# EAGLE board atmega2560.2 (EAGLE 8.3.0)
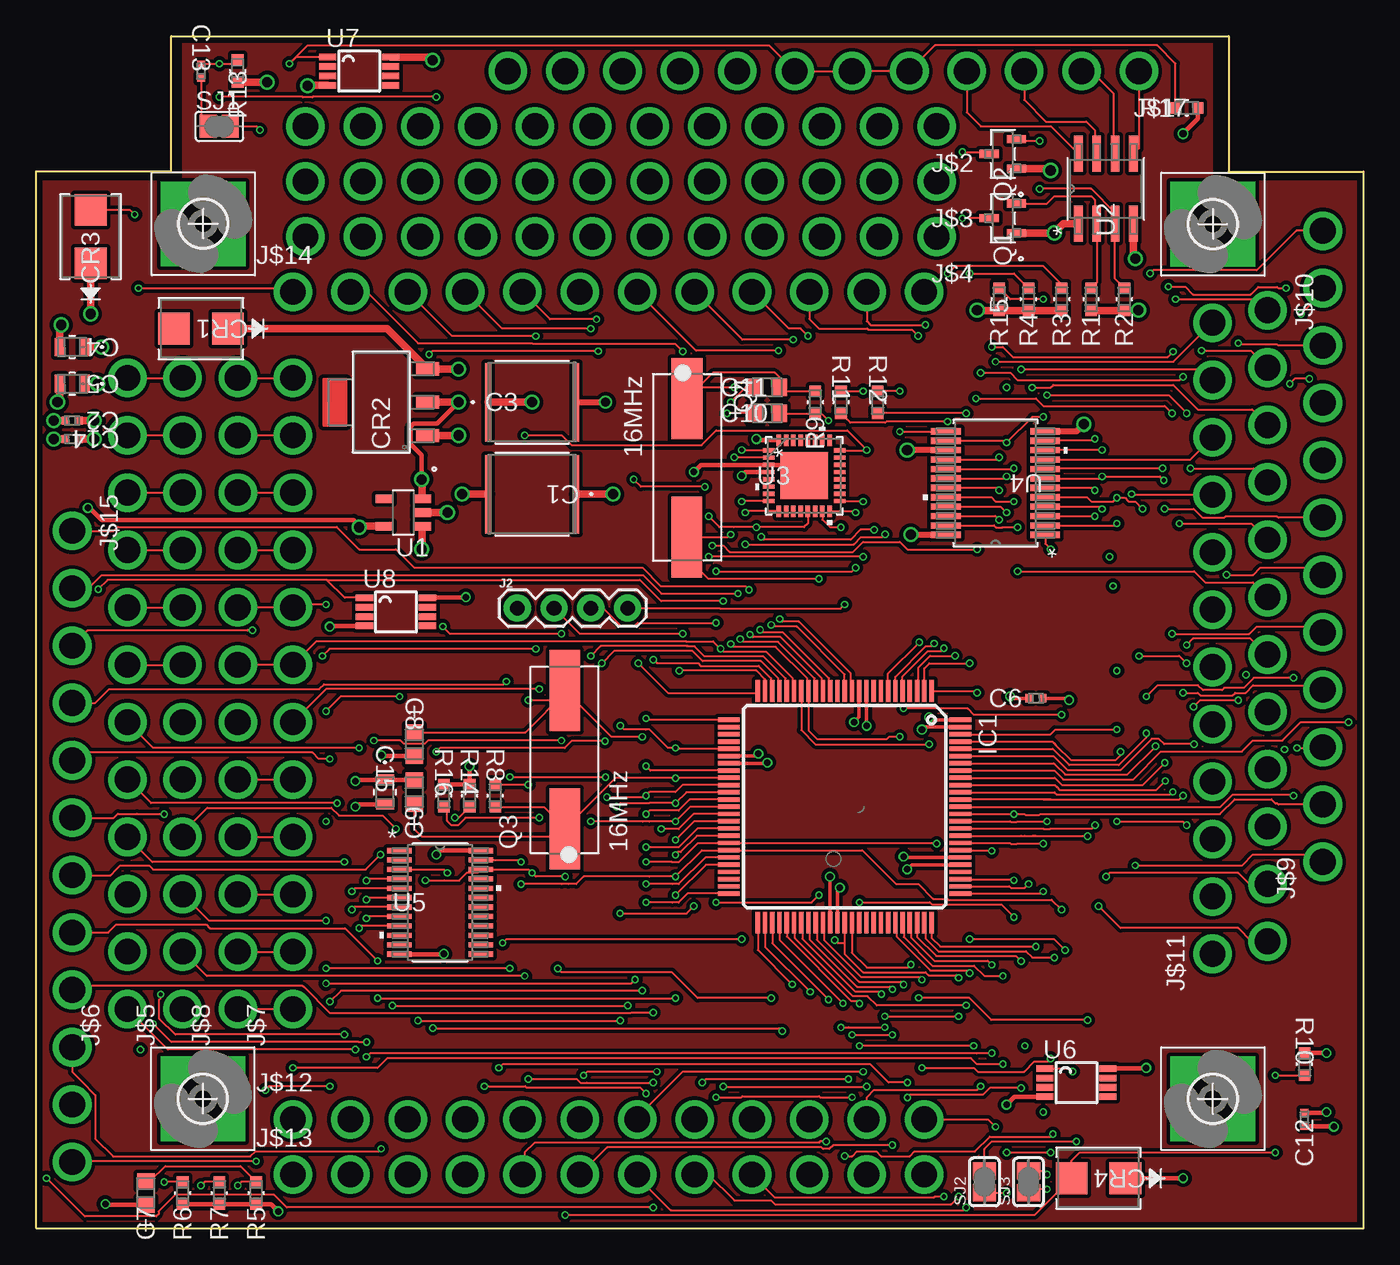
[diagram p7: board, top side]
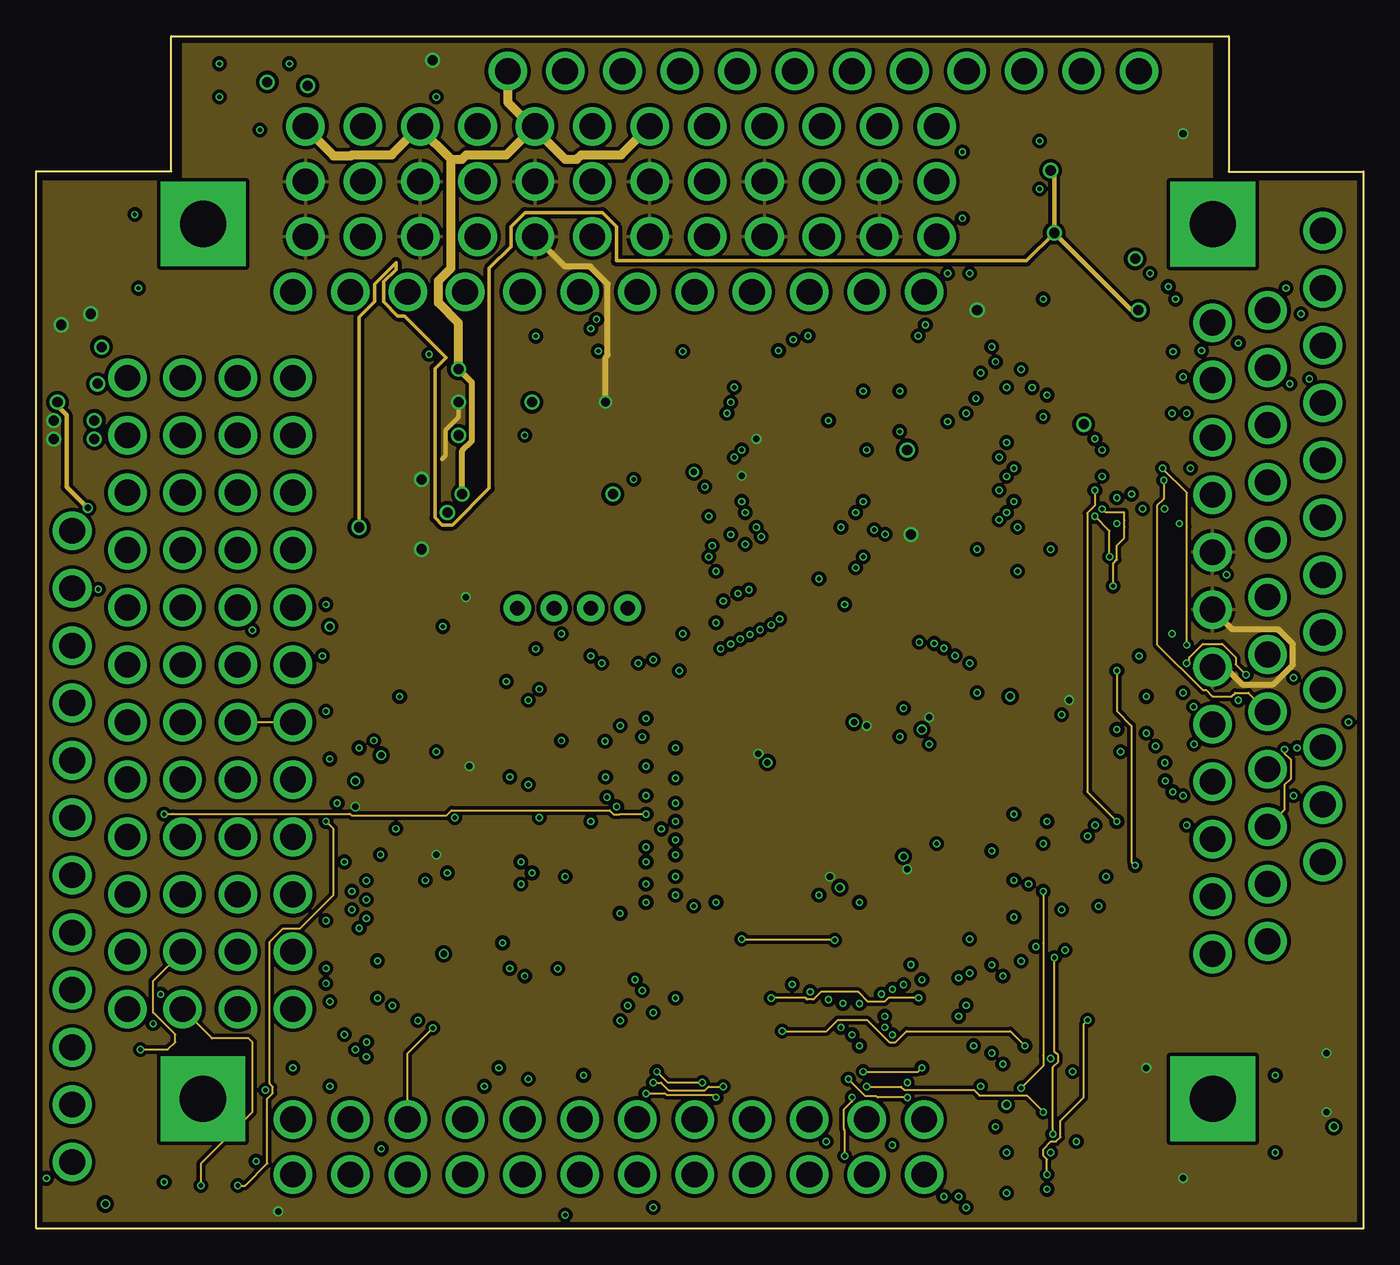
[diagram p8: board, inner layer Route2]
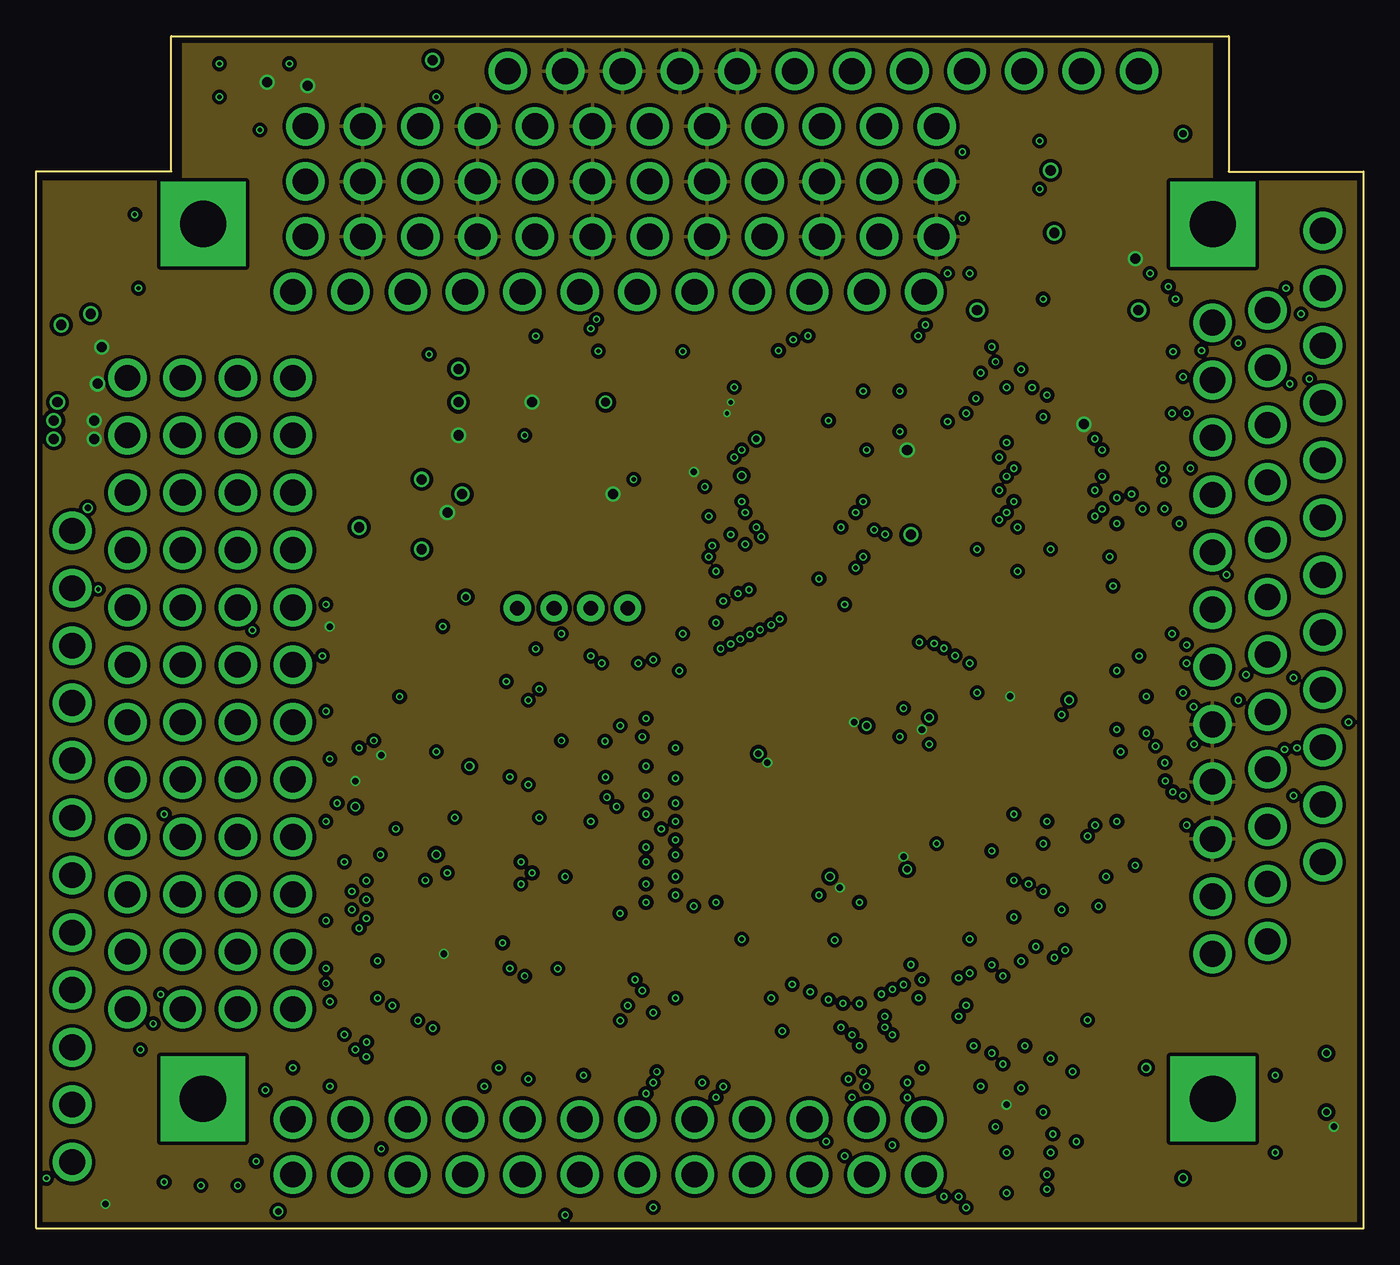
[diagram p9: board, inner layer Route15]
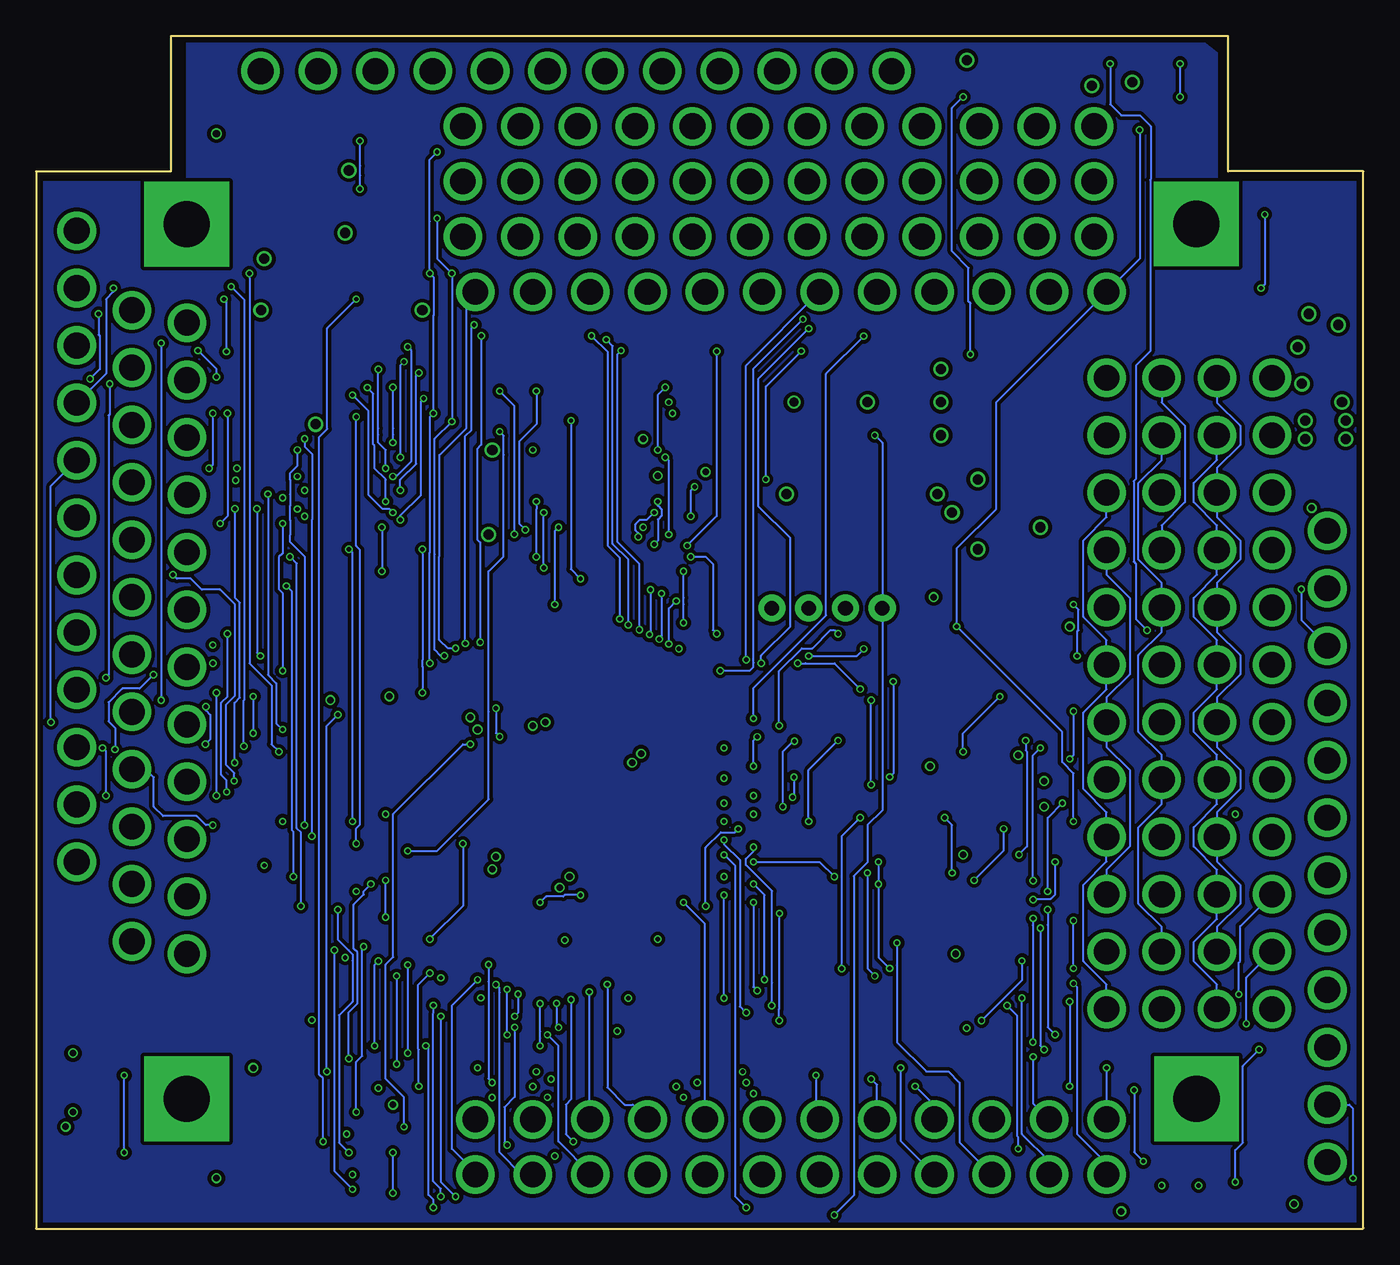
[diagram p10: board, bottom side, seen from below]

Size 91.64 x 82.35 mm. Coordinates in mm from the lower left corner, seen from the top.
Outline: 0,0.03 0,73.02 9.32,73.02 9.32,82.35 82.35,82.35 82.35,73 91.64,73 91.64,0 0.03,0 0,0.03
Copper layers (1*2*15*16): Top 0.035559375mm / dielectric 0.17018125mm / Route2 0.01778125mm / dielectric 47mil / Route15 0.01778125mm / dielectric 0.17018125mm / Bottom 0.035559375mm
Design rules "oshpark-4layer": minimum track width 5mil, minimum drill 10mil, track to track 5mil, track to pad 5mil, pad to pad 5mil, via to via 5mil, smd to smd 5mil, copper to edge 15mil, drill to drill 6mil, minimum pad ring 4mil, minimum via ring 4mil, stop-mask expansion 2.5mil, vias tented up to drill 0mil, thermal gap 10mil
Net classes: 0 default: width 0.203 mm, drill 0.406 mm, clearance 0.203 mm; 1 power: width 0.254 mm; 2 gnd: width 0.305 mm, drill 0.406 mm, clearance 0.203 mm; 3 power usb: width 0.508 mm, drill 0.406 mm, clearance 0.203 mm

## Footprints (pad centres in the part's own frame; a part is rotated, then mirrored left to right if it is on the bottom)
CAP_5750 = smd 0.406 x 5.41: 1 -3.048,0; 2 3.048,0
CAP_01 = smd 0.508 x 0.559: 1 -0.47,0; 2 0.47,0
CAP_GRM219R61A106KE44D = smd 0.711 x 1.245: 1 -0.851,0; 2 0.851,0
CC0805N = smd 1.067 x 1.219: 1 -0.826,0; 2 0.826,0
DIODE_600V_3A = smd 2.18 x 2.21: 1 -1.857,0; 2 1.857,0
SOT-223 = smd 0.914 x 1.6: 1 -2.3,-3.2; 2 0,-3.2; 3 2.3,-3.2
3,2-PAD-SQUARE = drill 3.2 pad 5.842 square: B3,2 0,0
TQFP100 = smd 1.5 x 0.3: 1 -8,6; 2 -8,5.5; 3 -8,5; 4 -8,4.5; 5 -8,4; 6 -8,3.5; 7 -8,3; 8 -8,2.5; 9 -8,2; 10 -8,1.5; 11 -8,1; 12 -8,0.5; 13 -8,0; 14 -8,-0.5; 15 -8,-1; 16 -8,-1.5; 17 -8,-2; 18 -8,-2.5; 19 -8,-3; 20 -8,-3.5; 21 -8,-4; 22 -8,-4.5; 23 -8,-5; 24 -8,-5.5; 25 -8,-6; 51 8,-6; 52 8,-5.5; 53 8,-5; 54 8,-4.5; 55 8,-4; 56 8,-3.5; 57 8,-3; 58 8,-2.5; 59 8,-2; 60 8,-1.5; 61 8,-1; 62 8,-0.5; 63 8,0; 64 8,0.5; 65 8,1; 66 8,1.5; 67 8,2; 68 8,2.5; 69 8,3; 70 8,3.5; 71 8,4; 72 8,4.5; 73 8,5; 74 8,5.5; 75 8,6 | smd 0.3 x 1.5: 26 -6,-8; 27 -5.5,-8; 28 -5,-8; 29 -4.5,-8; 30 -4,-8; 31 -3.5,-8; 32 -3,-8; 33 -2.5,-8; 34 -2,-8; 35 -1.5,-8; 36 -1,-8; 37 -0.5,-8; 38 0,-8; 39 0.5,-8; 40 1,-8; 41 1.5,-8; 42 2,-8; 43 2.5,-8; 44 3,-8; 45 3.5,-8; 46 4,-8; 47 4.5,-8; 48 5,-8; 49 5.5,-8; 50 6,-8; 76 6,8; 77 5.5,8; 78 5,8; 79 4.5,8; 80 4,8; 81 3.5,8; 82 3,8; 83 2.5,8; 84 2,8; 85 1.5,8; 86 1,8; 87 0.5,8; 88 0,8; 89 -0.5,8; 90 -1,8; 91 -1.5,8; 92 -2,8; 93 -2.5,8; 94 -3,8; 95 -3.5,8; 96 -4,8; 97 -4.5,8; 98 -5,8; 99 -5.5,8; 100 -6,8
1X04 = drill 1.016 pad 1.88: 1 0,0; 2 2.54,0; 3 5.08,0; 4 7.62,0
WIREWRAPPOST = drill 1.778 pad 2.54: 1 0,0; 2 3.962,0; 3 7.925,0; 4 11.887,0; 5 15.85,0; 6 19.812,0; 7 23.774,0; 8 27.737,0; 9 31.699,0; 10 35.662,0; 11 39.624,0; 12 43.586,0
SOT-23 = smd 0.561 x 1.321: D 0,0.945; G -1.025,-0.945; S 1.025,-0.945
OSCILLATOR = smd 5.588 x 2.108: 1 2.798,1.05 | smd 5.6 x 2.1: 2 12.36,1.04
RC0603N = smd 0.762 x 0.813: 1 -0.775,0; 2 0.775,0
SJ = smd 1.168 x 1.6: 1 -0.762,0; 2 0.762,0
SOLDERJUMPER_CLOSEDWIRE = smd 1.168 x 1.6: 1 -0.762,0; 2 0.762,0 | smd 0.635 x 0.203: WIRE 0,0
SOT23-5 = smd 0.6 x 1.2: EN 0.95,-1.306; GND 0,-1.306; IN -0.95,-1.306; NC/ADJ 0.95,1.306; OUT -0.95,1.306
R_8-M = smd 2.489 x 0.61: 1 -2.413,1.905; 2 -2.413,0.635; 3 -2.413,-0.635; 4 -2.413,-1.905; 5 2.413,-1.905; 6 2.413,-0.635; 7 2.413,0.635; 8 2.413,1.905
32M1-A = smd 0.805 x 0.3: 1 -2.452,1.75; 2 -2.452,1.25; 3 -2.452,0.75; 4 -2.452,0.25; 5 -2.452,-0.25; 6 -2.452,-0.75; 7 -2.452,-1.25; 8 -2.452,-1.75; 17 2.452,-1.75; 18 2.452,-1.25; 19 2.452,-0.75; 20 2.452,-0.25; 21 2.452,0.25; 22 2.452,0.75; 23 2.452,1.25; 24 2.452,1.75 | smd 0.3 x 0.805: 9 -1.75,-2.452; 10 -1.25,-2.452; 11 -0.75,-2.452; 12 -0.25,-2.452; 13 0.25,-2.452; 14 0.75,-2.452; 15 1.25,-2.452; 16 1.75,-2.452; 25 1.75,2.452; 26 1.25,2.452; 27 0.75,2.452; 28 0.25,2.452; 29 -0.25,2.452; 30 -0.75,2.452; 31 -1.25,2.452; 32 -1.75,2.452 | smd 3.25 x 3.25: 33 0,0
DB24 = smd 2.057 x 0.432: 1 -3.429,3.575; 2 -3.429,2.925; 3 -3.429,2.275; 4 -3.429,1.625; 5 -3.429,0.975; 6 -3.429,0.325; 7 -3.429,-0.325; 8 -3.429,-0.975; 9 -3.429,-1.625; 10 -3.429,-2.275; 11 -3.429,-2.925; 12 -3.429,-3.575; 13 3.429,-3.575; 14 3.429,-2.925; 15 3.429,-2.275; 16 3.429,-1.625; 17 3.429,-0.975; 18 3.429,-0.325; 19 3.429,0.325; 20 3.429,0.975; 21 3.429,1.625; 22 3.429,2.275; 23 3.429,2.925; 24 3.429,3.575
PW24 = smd 1.676 x 0.356: 1 -2.819,3.575; 2 -2.819,2.925; 3 -2.819,2.275; 4 -2.819,1.625; 5 -2.819,0.975; 6 -2.819,0.325; 7 -2.819,-0.325; 8 -2.819,-0.975; 9 -2.819,-1.625; 10 -2.819,-2.275; 11 -2.819,-2.925; 12 -2.819,-3.575; 13 2.819,-3.575; 14 2.819,-2.925; 15 2.819,-2.275; 16 2.819,-1.625; 17 2.819,-0.975; 18 2.819,-0.325; 19 2.819,0.325; 20 2.819,0.975; 21 2.819,1.625; 22 2.819,2.275; 23 2.819,2.925; 24 2.819,3.575
SOP65P500X110-8N = smd 1.2 x 0.45: 1 -2.175,0.975; 2 -2.175,0.325; 3 -2.175,-0.325; 4 -2.175,-0.975; 5 2.175,-0.975; 6 2.175,-0.325; 7 2.175,0.325; 8 2.175,0.975

## Placement (x,y rotation side)
C1  47uF  [CAP_5750]  34.24,50.72 180 top
C2  0.1uF  [CAP_01]  2.49,55.8 180 top
C3  47uF  [CAP_5750]  34.24,57.07 0 top
C4  10uF  [CAP_GRM219R61A106KE44D]  2.49,60.88 180 top
C5  10uF  [CAP_GRM219R61A106KE44D]  2.49,58.34 180 top
C6  0.1uF  [CAP_01]  69.04,36.63 0 top
C7  22pF  [CC0805N]  7.57,2.46 90 top
C8  22pF  [CC0805N]  26.11,33.45 270 top
C9  22pF  [CC0805N]  26.11,30.15 90 top
C10  22pF  [CC0805N]  50.5,56.31 0 top
C11  22pF  [CC0805N]  50.5,58.09 0 top
C12  0.1uF  [CAP_01]  87.58,7.54 90 top
C13  0.1uF  [CAP_01]  11.38,79.93 270 top
C14  0.1uF  [CAP_01]  2.49,54.53 180 top
C15  10uF  [CAP_GRM219R61A106KE44D]  24.08,30.15 270 top
CR1  [DIODE_600V_3A]  11.38,62.15 180 top
CR2  LD1117S50CTR  [SOT-223]  23.83,57.07 90 top
CR3  [DIODE_600V_3A]  3.76,68.5 90 top
CR4  [DIODE_600V_3A]  73.36,3.48 180 top
H1  MOUNT-PAD-SQUARE3.2  [3,2-PAD-SQUARE]  81.25,69.37 0 top
H2  MOUNT-PAD-SQUARE3.2  [3,2-PAD-SQUARE]  11.51,8.97 0 top
H3  MOUNT-PAD-SQUARE3.2  [3,2-PAD-SQUARE]  81.25,8.97 0 top
H4  MOUNT-PAD-SQUARE3.2  [3,2-PAD-SQUARE]  11.53,69.39 0 top
IC1  ATMEGA2560-16AU  [TQFP100]  55.83,29.13 270 top
J2  [1X04]  33.22,42.85 0 top
J$1  WIREPOST  [WIREWRAPPOST]  76.15,79.93 180 top
J$2  WIREPOST  [WIREWRAPPOST]  62.18,76.12 180 top
J$3  WIREPOST  [WIREWRAPPOST]  62.18,72.31 180 top
J$4  WIREPOST  [WIREWRAPPOST]  62.18,68.5 180 top
J$5  WIREPOST  [WIREWRAPPOST]  10.11,15.16 90 top
J$6  WIREPOST  [WIREWRAPPOST]  6.3,15.16 90 top
J$7  WIREPOST  [WIREWRAPPOST]  17.73,15.16 90 top
J$8  WIREPOST  [WIREWRAPPOST]  13.92,15.16 90 top
J$9  WIREPOST  [WIREWRAPPOST]  88.85,25.32 90 top
J$10  WIREPOST  [WIREWRAPPOST]  85.04,63.42 270 top
J$11  WIREPOST  [WIREWRAPPOST]  81.23,18.97 90 top
J$12  WIREPOST  [WIREWRAPPOST]  17.73,7.54 0 top
J$13  WIREPOST  [WIREWRAPPOST]  17.73,3.73 0 top
J$14  WIREPOST  [WIREWRAPPOST]  17.73,64.69 0 top
J$15  WIREPOST  [WIREWRAPPOST]  2.49,48.18 270 top
Q1  BSS138  [SOT-23]  66.75,69.77 90 top
Q2  BSS138  [SOT-23]  66.75,74.22 90 top
Q3  16MHz  [OSCILLATOR]  37.54,24.82 90 top
Q4  16MHz  [OSCILLATOR]  43.89,60.12 270 top
R1  10K  [RC0603N]  72.85,64.19 90 top
R2  10K  [RC0603N]  75.13,64.19 90 top
R3  10K  [RC0603N]  70.82,64.19 90 top
R4  10K  [RC0603N]  68.53,64.19 90 top
R5  10K  [RC0603N]  15.19,2.46 90 top
R6  10K  [RC0603N]  10.11,2.46 90 top
R7  10K  [RC0603N]  12.65,2.46 90 top
R8  1M  [RC0603N]  31.7,29.9 270 top
R9  1M  [RC0603N]  53.8,57.07 90 top
R10  10K  [RC0603N]  87.58,11.35 270 top
R11  1K  [RC0603N]  55.58,57.07 270 top
R12  1K  [RC0603N]  58.12,57.07 270 top
R13  1K  [RC0603N]  13.92,79.93 90 top
R14  10K  [RC0603N]  29.92,29.9 270 top
R15  10K  [RC0603N]  66.5,64.19 90 top
R16  10K  [RC0603N]  28.14,29.9 270 top
R17  [RC0603N]  79.45,77.39 0 top
SJ1  [SJ]  12.65,76.12 0 top
SJ2  [SOLDERJUMPER_CLOSEDWIRE]  65.48,3.23 90 top
SJ3  [SOLDERJUMPER_CLOSEDWIRE]  68.53,3.23 90 top
U1  MIC5225  [SOT23-5]  25.35,49.45 90 top
U2  ADM3488ARZR_8-M  [R_8-M]  73.86,71.81 90 top
U3  [32M1-A]  53.04,51.99 0 top
U4  CD74HC4067SM96  [DB24]  66.24,51.49 180 top
U5  TCA9548APWR  [PW24]  27.89,22.53 0 top
U6  DS18B20U+T&R  [SOP65P500X110-8N]  71.83,10.08 0 top
U7  DS18B20U+T&R  [SOP65P500X110-8N]  22.3,79.93 0 top
U8  DS18B20U+T&R  [SOP65P500X110-8N]  24.84,42.6 0 top

## Tracks (layer width: path | path; a pad name or v marks a point on that pad's centre or on a via)
0SCL  (via drill 0.3)
  Top 0.127: U5.5 22.01,23.5 v21.79,23.29 | v20.78,29.39 7.93,29.39 J$6.5
  Bottom 0.127: v21.79,23.29 21.79,28.37 v20.78,29.39
0SDA  (via drill 0.3)
  Top 0.127: U5.4 22.94,24.15 v22.81,24.02 | v22.3,33.2 8.08,33.2 J$6.6
  Bottom 0.127: v22.81,24.02 22.81,32.69 v22.3,33.2
1SCL  (via drill 0.3)
  Top 0.127: U5.7 21.98,22.2 v21.79,22.02 | v8.6,16.18 8.6,15.91 8.51,15.83 8.51,14.5 9.6,13.41 v21.29,13.41
  Bottom 0.127: v21.79,22.02 21.79,20.98 21.78,20.97 21.78,13.9 v21.29,13.41 | v8.6,16.18 8.6,18.38 8.51,18.46 8.51,20.88 J$6.3
1SDA  (via drill 0.3)
  Top 0.127: U5.6 22.94,22.85 v22.81,22.72 | v21.28,25.32 8.03,25.32 J$6.4
  Bottom 0.127: v21.28,25.32 21.28,23.08 21.58,22.77 22.76,22.77 v22.81,22.72
2SCL  (via drill 0.3)
  Top 0.127: U5.9 22.45,20.9 v22.3,20.75 | v22.05,12.37 9.09,12.37 J$6.1
  Bottom 0.127: v22.3,20.75 22.3,12.62 v22.05,12.37
2SDA  (via drill 0.3)
  Top 0.127: U5.8 22.94,21.55 v22.81,21.42 | v22.82,12.88 22.27,12.88 22.26,12.89 9.34,12.89 v8.08,14.15
  Bottom 0.127: v22.81,21.42 22.81,20.98 22.82,20.97 v22.82,12.88 | v8.08,14.15 8.08,17.35 J$6.2
3.3V  (via drill 0.45, 0.7)
  Top 0.305: v3.56,49.76 3.7,49.76 4.52,48.95 21.93,48.95 22.37,48.5
  Top 0.508: U1.OUT 22.37,48.5 v22.3,48.44 | C5.2 1.64,57.24 v1.47,57.07 | v70.3,68.75 Q1.G | v70.3,68.75 v70.31,68.76 | Q2.G 69.94,73.19 v70.05,73.08 | U2.1 70.94,69.39 v70.3,68.75 | R1.1 R2.1 76.11,63.41 v76.12,63.42
  Route2 0.254: v22.3,48.44 22.3,62.95 23.36,64 23.36,65.24 24.84,66.73 24.84,66.23 23.99,65.38 23.99,64 24.97,63.03 25.43,63.03 28.3,60.15 27.54,59.39 27.54,49.1 28.04,48.6 28.75,48.6 31.28,51.13 31.28,66.32 32.78,67.81 32.78,69.19 33.75,70.17 39.09,70.17 40.07,69.19 40.07,66.84 68.39,66.84 v70.31,68.76
  Route2 0.305: v1.47,57.07 1.47,56.79 2.1,56.17 2.1,51.22 v3.56,49.76 | v76.12,63.42 75.64,63.42 v70.31,68.76 70.31,72.82 v70.05,73.08
5V  (via drill 0.45, 0.5, 0.6, 0.7)
  Top 0.254: IC1.61 54.83,24.29 v54.81,24.31 | IC1.80 60.47,25.13 v60.15,24.82 | IC1.100 61.84,35.13 v61.67,35.3 | C6.2 71.2,36.63 v71.32,36.5 | IC1.10 57.33,34.75 v57.35,34.72 | IC1.31 49.71,32.63 v49.87,32.8
  Top 0.305: U3.4 48.97,52.24 v48.72,51.99 | U3.32 49.82,54.45 v49.73,54.53 | U8.8 29.63,43.57 v29.67,43.61 | U6.8 76.62,11.06 v76.66,11.1 | CR4.1 v79.2,3.48 | C12.2 89.07,8.01 v89.1,8.05 | R10.1 89.09,12.13 v89.1,12.12 | R6.1 R7.1 R5.1 16.22,1.69 v16.71,1.19 | U5.24 27.91,26.1 v27.64,25.83 | C15.2 22.21,29.3 v22.05,29.13 | R16.1 R14.1 v29.92,31.93 | v29.16,57.07 27.67,55.59 26.08,55.59 25.87,55.38 25.87,54.17 26.62,53.42 v26.62,51.74 | R17.2 80.23,76.64 v79.2,75.62
  Top 0.406: U4.24 60.42,47.91 v60.4,47.93 | C3.2 v39.32,57.07
  Top 0.508: v29.16,57.07 CR2.2 | U1.EN 26.66,51.7 v26.62,51.74 | U1.IN 26.66,46.95 v26.62,46.91 | CR3.1 v3.76,63.17 | C4.2 1.64,62.32 v1.73,62.41 | C14.2 v1.22,54.53 | C2.2 v1.22,55.8 | U7.8 27.17,80.91 v27.38,80.7 | R3.1 R4.1 R15.1 64.99,63.41 v64.97,63.42
  Route2 0.305: v29.16,57.07 29.16,56.03 28.28,55.15 28.28,53.4 28.02,53.14
  Route2 0.406: J$11.7 82.59,41.39 85.76,41.39 86.78,40.37 86.78,38.93 85.44,37.58 83.28,37.58 82.08,38.79 J$11.6 | v39.32,57.07 39.32,60.18 39.47,60.33 39.47,65.23 38.26,66.43 36.51,66.43 J$4.8
  pour Route2 (isolate 0.254): -0.05,-0.08 91.39,-0.08 91.39,72.31 81.23,72.31 81.23,82.22 10.11,82.22 10.11,72.31 -0.05,72.31
AREF  (via drill 0.3)
  Top 0.127: J$11.9 75.69,50.67 v75.64,50.72 | v74.63,34.47 70.38,34.47 70.04,34.13 IC1.98
  Bottom 0.127: v75.64,50.72 75.64,38.24 75.06,37.65 75.06,34.9 v74.63,34.47
CAM1_CS  (via drill 0.3)
  Top 0.127: v42.62,39.29 42.87,39.05 45.7,39.05 45.89,38.86 49.88,38.86 50.75,37.99 50.75,37.22 IC1.23
  Bottom 0.127: v42.62,39.29 42.62,59.61 J$14.6
CAM2_CS  (via drill 0.3)
  Top 0.127: IC1.24 50.33,37.94 49.73,38.53 v44.4,38.53 | v38.7,62.8 35.47,62.8 J$14.5
  Bottom 0.127: v44.4,38.53 42.37,38.53 42.11,38.79 42.11,39.07 42.1,39.08 42.1,59.4 v38.7,62.8
CAM3_CS  (via drill 0.3)
  Top 0.127: v41.58,39.04 43.62,37.01 49.7,37.01 IC1.25 | v38.3,62.15 32.16,62.15 J$14.4
  Bottom 0.127: v41.58,39.04 41.58,39.57 39.57,41.58 39.57,47.68 41.77,49.88 41.77,58.68 v38.3,62.15
D7  (via drill 0.3)
  Top 0.127: v49.29,41.03 49.48,40.84 51.4,40.84 54.25,37.99 54.25,37.22 IC1.16 | J$15.1 5.36,48.18 5.64,48.46 20.75,48.46 22.3,46.91 24.84,46.91 26.11,45.64 41.86,45.64 43.13,44.37 48.97,44.37 v49.23,44.12
  Bottom 0.127: v49.23,44.12 49.23,41.1 v49.29,41.03
D8  (via drill 0.3)
  Top 0.127: v48.61,40.71 48.81,40.51 51.23,40.51 53.75,37.99 53.75,37.22 IC1.17 | J$15.2 3.61,44.22 4.52,45.14 41.9,45.14 43.18,43.86 v48.46,43.86
  Bottom 0.127: v48.46,43.86 48.46,40.86 v48.61,40.71
DTR  (via drill 0.3)
  Top 0.127: U3.13 53.29,48.69 53.04,48.44 v49.73,48.44 48.18,48.44 48.17,48.45 47.18,48.45 46.69,48.95 v46.44,49.2 | v46.18,51.23 41.76,51.23 v41.25,51.74 | v38.81,60.6 27.35,60.6 v27.13,60.38 | v27.64,78.16 19.1,78.16 19.07,78.13 18.42,78.13 18.39,78.16 v12.65,78.16 | C13.1 11.42,80.44 v12.65,80.44 13.65,80.44 R13.2
  Bottom 0.127: v46.44,49.2 46.44,50.97 v46.18,51.23 | v41.25,51.74 41.25,58.16 v38.81,60.6 | v27.13,60.38 27.13,63.9 27.25,64.03 27.25,66.34 28.4,67.49 28.4,77.39 v27.64,78.16 | v12.65,78.16 v12.65,80.44
FRAM1  (via drill 0.3)
  Top 0.127: J$12.12 65.74,7.54 v66.24,7.04 | v61.67,33.45 53.8,33.45 52.83,34.42 IC1.19
  Bottom 0.127: v66.24,7.04 66.24,9.07 67.51,10.34 67.51,18.24 67,18.76 67,28.64 62.18,33.45 v61.67,33.45
FRAM2  (via drill 0.3)
  Top 0.127: IC1.70 59.41,21.05 59.41,20.17 61.75,17.83 64.28,17.83 v64.47,17.64 | J$12.11 57.35,9.07 57.86,9.58 64.97,9.58 v65.23,9.83
  Bottom 0.127: 64.47,17.7 v64.47,17.64 65.26,16.85 65.26,12.41 65.23,12.38 v65.23,9.83
FRAM3  (via drill 0.3)
  Top 0.127: IC1.52 50.33,19.47 v53.46,16.35
  Bottom 0.127: v53.46,16.35 53.46,7.61 J$12.10
FRAM4  (via drill 0.3)
  Top 0.127: IC1.51 49.83,19.24 v52.2,16.87
  Bottom 0.127: v52.2,16.87 52.2,9.76 51,8.56 50.44,8.56 J$12.9
FRAM5  (via drill 0.3)
  Top 0.127: IC1.78 67.43,24.13 v67.51,24.05 | v46.94,22.53 53.54,22.53 v54.05,23.04 | v56.85,22.53 61.71,22.53 61.86,22.39 66.64,22.39 v67.51,21.51
  Bottom 0.127: J$12.8 45.47,21.06 v46.94,22.53 | v54.05,23.04 55.15,23.04 55.25,22.94 56.43,22.94 v56.85,22.53 | v67.51,21.51 v67.51,24.05
FRAM6  (via drill 0.3)
  Top 0.127: IC1.77 67.2,23.63 67.3,23.54 68.27,23.54 v68.53,23.8 | J$12.7 41.5,7.7 44.65,10.85 57.09,10.85 v57.1,10.84 | v61.16,11.1 64.76,11.1 65.02,10.84 68.23,10.84 68.95,11.55 69.87,11.55 v70.05,11.74
  Route2 0.127: v57.1,10.84 60.9,10.84 v61.16,11.1
  Bottom 0.127: v70.05,11.74 70.05,14.95 69.46,15.55 69.46,19.07 69.72,19.34 69.72,22.38 69.03,23.08 69.03,23.3 v68.53,23.8
FRAM7  (via drill 0.3)
  Top 0.127: IC1.76 69.39,23.13 v69.55,23.29 | v60.16,9.06 60.35,9.25 65.38,9.25 65.85,9.72 v68.02,9.72 | v56.09,10.33 46.23,10.33 v45.98,10.08 | v42.87,10.84 38.04,10.84 v37.8,10.59
  Route2 0.127: v69.55,23.29 69.55,19.71 69.56,19.7 69.56,11.97 69.54,11.95 69.54,11.23 v68.02,9.72 | v60.16,9.06 58.1,9.06 58.02,9.14 57.28,9.14 v56.09,10.33 | v45.98,10.08 43.62,10.08 v42.87,10.84
  Bottom 0.127: v37.8,10.59 37.8,7.8 J$12.6
FRAM8  (via drill 0.3)
  Top 0.127: IC1.75 61.83,20.09 62.43,19.48 v69.04,19.48 | v33.99,10.34 37.32,10.34 37.58,10.07 38.01,10.07 38.02,10.08 v42.62,10.08 | v47.45,9.81 v57.35,9.81 v57.35,9.8
  Route2 0.127: v42.62,10.08 43.15,10.08 43.67,9.57 46.2,9.57 46.44,9.81 v47.45,9.81 | v57.35,9.8 59.72,9.8 59.94,9.58 64.75,9.58 65.13,9.2 68.4,9.2 v69.55,8.05
  Bottom 0.127: J$12.5 33.58,9.93 v33.99,10.34 | v69.55,8.05 69.55,11.51 69.13,11.93 69.13,19.39 v69.04,19.48
FRAM9  (via drill 0.3)
  Top 0.127: IC1.74 61.41,21.05 61.41,20.04 62.3,19.15 68.35,19.15 68.78,18.72 v70.31,18.72 | v30.94,9.83 33.76,9.83 33.85,9.74 41.7,9.74 v42.11,9.33 | v46.94,9.07 48.69,9.07 48.77,9.14 54.05,9.14 54.13,9.07 v56.34,9.07 | v55.83,5 56.36,5 56.69,5.33 58.02,5.33 58.35,5 60.32,5 60.65,5.33 64.84,5.33 65.85,6.35 70.02,6.35 v70.21,6.54
  Route2 0.127: v42.11,9.33 43.43,9.33 43.53,9.24 46.77,9.24 v46.94,9.07 | v56.34,9.07 56.34,8.79 55.75,8.21 55.75,6.88 55.83,6.8 v55.83,5 | v70.21,6.54 70.21,11.16 70.57,11.52 70.57,11.95 70.31,12.22 v70.31,18.72
  Bottom 0.127: J$12.4 29.62,8.51 v30.94,9.83
FRAM10  (via drill 0.3)
  Top 0.127: IC1.73 60.83,20.15 62.16,18.82 67.67,18.82 v68.02,18.47 | v27.38,13.84 51.31,13.84 v51.51,13.64
  Route2 0.127: J$12.3 25.65,12.11 v27.38,13.84 | v68.28,12.62 67.26,13.64 60.11,13.64 59.34,12.87 58.91,12.87 57.36,14.41 55.36,14.41 54.59,13.64 v51.51,13.64
  Bottom 0.127: v68.28,12.62 68.28,18.21 v68.02,18.47
FRAM11  (via drill 0.3)
  Top 0.127: v65.99,18.21 65.71,18.49 62.02,18.49 60.41,20.1 60.41,21.05 IC1.72 | v65.99,12.12 64.97,12.12 64.95,12.11 23.05,12.11 v22.81,11.86
  Bottom 0.127: v65.99,18.21 v65.99,12.12 | v22.81,11.86 22.81,8.66 J$12.2
FRAM12  (via drill 0.3)
  Top 0.127: IC1.71 59.91,21.05 59.91,20.13 61.89,18.16 64.77,18.16 65.48,17.45 v66.75,17.45 | v66.75,11.35 64.97,11.35 64.55,11.77 24.25,11.77 23.57,11.1 v17.73,11.1
  Bottom 0.127: v66.75,17.45 v66.75,11.35 | v17.73,11.1 J$12.1
FRAM13  (via drill 0.3)
  Top 0.127: v61.16,17.19 60.98,17.37 56.96,17.37 54.41,19.92 54.41,21.05 IC1.60
  Bottom 0.127: v61.16,17.19 61.16,17.2 62.94,15.42 62.94,5.51 61.32,3.89 J$13.12
FRAM14  (via drill 0.3)
  Top 0.127: v59.89,16.85 59.71,17.04 56.83,17.04 53.91,19.96 53.91,21.05 IC1.59
  Bottom 0.127: J$13.11 58.12,3.73 59.64,5.26 59.64,16.3 59.65,16.31 59.65,16.61 v59.89,16.85
FRAM15  (via drill 0.3)
  Top 0.127: v59.13,16.52 58.94,16.71 56.69,16.71 53.41,19.99 53.41,21.05 IC1.58 | v56.34,13.39 v59.12,13.39
  Bottom 0.127: J$13.10 53.39,3.84 55.58,6.02 55.58,12.62 v56.34,13.39 | v59.12,13.39 v59.12,16.51 v59.13,16.52
FRAM16  (via drill 0.3)
  Top 0.127: v58.37,16.19 58.18,16.38 56.55,16.38 52.91,20.02 52.91,21.05 IC1.57 | v58.6,14.66 v63.7,14.66 | v62.69,2.21 62.05,2.21 61.98,2.13 51.03,2.13 J$13.9
  Bottom 0.127: v58.37,16.19 58.37,14.89 v58.6,14.66 | v63.7,14.66 63.7,3.23 v62.69,2.21
FRAM17  (via drill 0.3)
  Top 0.127: J$13.8 46.43,3.73 48.21,1.96 50.74,1.96 51,1.69 63.19,1.69 v63.7,2.21 | v64.21,15.42 58.05,15.42 57.41,16.05 56.42,16.05 52.41,20.06 52.41,21.05 IC1.56
  Bottom 0.127: v63.7,2.21 63.7,2.76 64.22,3.28 64.22,14.87 64.21,14.88 v64.21,15.42
FRAM18  (via drill 0.3)
  Top 0.127: v56.85,15.53 56.66,15.72 56.28,15.72 51.83,20.17 IC1.55 | J$13.7 41.5,3.58 43.82,1.27 64.02,1.27 v64.21,1.46 | v64.74,12.62 v56.85,12.62
  Bottom 0.127: v64.21,1.46 64.21,1.98 64.55,2.33 64.55,12.44 v64.74,12.62 | v56.85,12.62 56.85,13.16 56.86,13.17 56.86,13.6 56.85,13.61 v56.85,15.53
FRAM19  (via drill 0.3)
  Top 0.127: IC1.54 51.33,19.94 v55.71,15.56 | v55.58,13.89 56.11,13.89 56.12,13.9 v58.6,13.9 | v59.12,5.77 55.04,5.77 54.77,5.5 54.34,5.5 54.23,5.61 39.42,5.61 J$13.6
  Bottom 0.127: v55.71,15.56 55.71,14.03 v55.58,13.89 | v58.6,13.9 58.6,9.09 59.31,8.38 59.31,5.95 v59.12,5.77
FRAM20  (via drill 0.3)
  Top 0.127: IC1.53 50.83,19.71 v54.71,15.82 | v54.56,6.02 54.13,6.02 54.05,5.94 34.42,5.94 33.73,5.26 33.73,3.89 J$13.5
  Bottom 0.127: v54.71,15.82 54.71,8.92 55.07,8.56 55.07,6.53 v54.56,6.02
FRAM21  (via drill 0.3)
  Top 0.127: IC1.64 56.33,19.06 57.35,18.03 60.21,18.03 v60.4,18.22 | v60.16,10.09 58.87,10.09 57.61,11.35 32.21,11.35 v31.95,11.1
  Bottom 0.127: v60.4,18.22 60.4,17.08 60.41,17.07 60.41,10.35 v60.16,10.09 | v31.95,11.1 31.95,6.07 J$13.4
FRAM22  (via drill 0.3)
  Top 0.127: IC1.63 55.83,19.74 | v63.7,17.31 63.52,17.5 61.61,17.5 61.41,17.7 57.1,17.7 55.83,18.97 55.83,19.74 | 55.83,19.74 55.33,19.74 v55.14,19.93 | v32.21,19.74 32.46,19.99 v48.72,19.99
  Route2 0.127: v55.14,19.93 48.78,19.93 v48.72,19.99
  Bottom 0.127: 63.7,17.45 v63.7,17.31 | v32.21,19.74 32.21,18.19 32.2,18.18 32.2,12.87 30.18,10.85 28.65,10.85 27.89,10.08 27.89,5.97 J$13.3
FRAM23  (via drill 0.3)
  Top 0.127: IC1.26 42.21,35.13 v42.11,35.23 | v34.49,61.64 28.71,61.64 J$14.3
  Bottom 0.127: v42.11,35.23 42.11,37.33 37.1,42.35 37.1,59.03 v34.49,61.64
FRAM24  (via drill 0.3)
  Top 0.127: IC1.1 64.85,37.13 v64.97,37.01 | J$14.2 22.81,64.69 26.37,61.14 34.26,61.14 34.28,61.12 44.11,61.12 v44.65,60.57 | v46.69,47.17 47.45,47.17 47.88,46.74 56.41,46.74 57.1,47.42 59.64,47.42 60.15,46.91 v64.97,46.91
  Bottom 0.127: v44.65,60.57 44.65,49.2 v46.69,47.17 | v64.97,46.91 64.97,39.26 64.98,39.25 64.98,38.82 64.97,38.81 v64.97,37.01
FRAM25  (via drill 0.3)
  Top 0.127: v62.69,40.08 62.5,39.89 61.59,39.89 59.83,38.13 IC1.5
  Bottom 0.127: v62.69,40.08 63.22,40.08 63.81,40.67 63.81,46.41 63.79,46.43 63.79,53.43 61.93,55.3 61.93,64.08 J$14.12
FRAM26  (via drill 0.3)
  Top 0.127: v62.02,40.41 61.83,40.22 61.45,40.22 59.33,38.1 IC1.6 | J$14.11 57.35,62.66 57.61,62.41 v61.41,62.41
  Bottom 0.127: v62.02,40.41 62.02,54.74 61.6,55.16 61.6,62.22 v61.41,62.41
FRAM27  (via drill 0.3)
  Top 0.127: IC1.7 58.83,38.33 v60.99,40.49 | J$14.10 53.39,62.81 54.05,62.15 57.39,62.15 57.47,62.08 60.48,62.08 v60.91,61.65
  Bottom 0.127: 61.16,40.31 v60.99,40.49 60.99,47.39 61.19,47.6 61.19,53.85 60.91,54.13 v60.91,61.65
FRAM28  (via drill 0.3)
  Top 0.127: v51.34,42.1 51.53,41.91 52.66,41.91 56.25,38.33 56.25,37.22 IC1.12 | v53.29,61.65 52.78,62.15 51.97,62.15 J$14.9
  Bottom 0.127: v51.34,42.1 51.34,46.32 52.17,47.15 52.17,60.53 v53.29,61.65
FRAM29  (via drill 0.3)
  Top 0.127: IC1.13 55.83,38.28 52.53,41.58 50.86,41.58 v50.75,41.69 | v52.27,61.39 48.77,61.39 J$14.8
  Bottom 0.127: v50.75,41.69 50.75,46.19 51.84,47.28 51.84,60.96 v52.27,61.39
FRAM30  (via drill 0.3)
  Top 0.127: v49.99,41.36 50.18,41.17 51.57,41.17 54.75,37.99 54.75,37.22 IC1.15 | v51.26,60.63 45.57,60.63 J$14.7
  Bottom 0.127: v49.99,41.36 49.99,45.9 51.51,47.42 51.51,60.38 v51.26,60.63
GND  (via drill 0.3, 0.45, 0.7)
  Top 0.127: C10.1 v47.7,56.31 | C11.1 48.97,58.09 v47.96,57.07
  Top 0.254: IC1.62 55.33,23.38 v55.5,23.55 | IC1.81 59.95,25.63 v59.89,25.69 | IC1.99 61.33,34.63 v61.16,34.47 | C6.1 67.39,36.63 v67.26,36.75 | IC1.11 56.83,35.33 v56.48,34.98 | IC1.32 50.45,32.13 v50.5,32.18
  Top 0.305: U3.33 52.29,52.74 U3.3 45.91,52.74 v45.42,52.25 | U8.4 20.31,41.62 v20.27,41.58 | U6.4 67.55,9.11 v67.01,8.56 | C12.1 89.57,7.07 v89.61,7.04 | C7.1 4.84,1.64 v4.78,1.7 | U5.12 28.12,18.95 v28.14,18.97 | C9.2 24.1,30.98 C15.1 22.14,31 v22.05,30.91 | C8.2 23.89,32.63 v23.83,32.69
  Top 0.406: U4.15 60.16,53.76 v60.15,53.77 | U4.12 71.85,55.06 v72.34,55.55
  Top 0.508: C1.1 v39.83,50.72 | CR2.1 29.15,54.77 v29.16,54.79 | C3.1 v34.24,57.07 | U1.GND v28.4,49.45 | C5.1 v4.24,58.34 | C4.1 v4.52,60.88 | C2.1 v4.01,55.8 | C14.1 v4.01,54.53 | R13.1 15.94,79.16 v15.95,79.17 | U7.4 18.79,78.96 v18.75,78.92 | U2.4 75.77,67.11 v75.9,66.98
  Route15 0.254: v55.5,23.55 55.32,23.55
  Route15 0.508: v4.24,58.34 4.27,58.34
  pour Route15 (isolate 0.254): -0.05,-0.08 91.39,-0.08 91.39,72.31 81.23,72.31 81.23,82.22 10.11,82.22 10.11,72.31 -0.05,72.31
M8RXD  (via drill 0.3)
  Top 0.127: U3.8 48.75,50.24 v48.72,50.22 | v48.97,47.25 56.47,47.25 56.96,47.75 58.44,47.75 v58.62,47.94 | v59.64,57.84 R12.1
  Bottom 0.127: v48.72,50.22 48.72,49.93 48.45,49.67 48.45,49.24 48.72,48.97 48.72,47.51 v48.97,47.25 | v58.62,47.94 58.62,56.82 v59.64,57.84
M8TXD  (via drill 0.3)
  Top 0.127: U3.9 49.06,49.54 v48.97,49.45 | R11.1 57.09,57.85 v57.1,57.84 | v57.86,48.27 56.93,48.27 56.25,47.58 50.26,47.58 v50.07,47.77
  Bottom 0.127: v57.1,57.84 57.1,55.55 58.29,54.36 58.29,48.7 v57.86,48.27 | v50.07,47.77 50.07,48.04 50.25,48.22 50.25,48.65 49.95,48.96 49.47,48.96 v48.97,49.45
MISO  (via drill 0.3)
  Top 0.127: J$8.9 J$7.9 | J$8.3 J$7.3 | J$8.12 J$7.12 | IC1.22 51.25,37.22 51.25,37.99 50.05,39.19 46.03,39.19 45.31,39.9 45.15,39.9 45.14,39.89 39.92,39.89 v39.07,39.04 | v34.75,37.26 20.02,37.26 J$7.6
  Route2 0.127: J$8.6 J$7.6
  Bottom 0.127: J$7.9 17.73,45.16 16.13,43.56 16.13,38.28 17.73,36.67 J$7.6 17.73,33.28 16.13,31.68 16.13,26.39 17.73,24.79 J$7.3 | v39.07,39.04 38.53,39.04 38.52,39.03 36.52,39.03 v34.75,37.26 | J$8.12 13.92,57.05 12.32,55.45 12.32,50.16 13.92,48.56 J$8.9
MISO2  (via drill 0.3)
  Top 0.127: U3.17 57.07,50.24 v57.1,50.22 | v57.11,46.41 v46.44,46.41 | v44.65,41.07 37.54,41.07 J2.2
  Bottom 0.127: v57.1,50.22 57.1,49.68 57.11,49.67 v57.11,46.41 | v46.44,46.41 45.42,46.41 44.91,45.9 44.91,41.33 v44.65,41.07
MOSI  (via drill 0.3)
  Top 0.127: J$8.8 J$7.8 17.93,43.1 v20.02,43.1 | J$8.11 J$7.11 | J$8.5 J$7.5 | J$8.2 J$7.2 | v38.3,39.55 38.98,40.22 44.91,40.22 | 45,40.22 44.91,40.22 | v34.49,40.03 20.25,40.03 v19.76,39.55 | 45.02,40.23 45,40.22 | 45.47,40.21 45.45,40.23 | 45.47,40.21 46.16,39.52 50.22,39.52 51.75,37.99 51.75,37.22 IC1.21 | 44.91,40.22 45,40.22 | 45,40.22 45.02,40.23 | 45.02,40.23 45.45,40.23 | 45.45,40.23 45.47,40.21
  Bottom 0.127: J$8.2 13.92,20.83 15.52,22.43 15.52,27.71 13.92,29.31 J$8.5 13.92,32.71 15.52,34.31 15.52,39.6 13.92,41.2 J$8.8 13.92,44.6 15.52,46.2 15.52,51.49 13.92,53.09 J$8.11 | v38.3,39.55 34.98,39.55 v34.49,40.03 | v19.76,39.55 19.76,41.23 19.67,41.33 19.67,42.75 v20.02,43.1
MOSI2  (via drill 0.3)
  Top 0.127: U3.16 56.5,49.54 v56.59,49.45 | J2.3 39.14,42.85 40.34,41.64 41.34,41.64 41.53,41.83 v46.94,41.83 | v46.94,45.39 56.34,45.39 v56.59,45.64
  Bottom 0.127: v46.94,41.83 46.94,43.11 46.93,43.12 46.93,43.55 46.94,43.56 v46.94,45.39 | v56.59,45.64 v56.59,49.45
N$1
  pour Top (isolate 0.254): -0.05,-0.08 91.39,-0.08 91.39,72.31 81.23,72.31 81.23,82.22 10.11,82.22 10.11,72.31 -0.05,72.31
N$2
  pour Bottom (isolate 0.254): -0.05,-0.08 91.39,-0.08 91.39,72.31 81.23,72.31 81.23,82.22 11.38,82.22 10.11,81.2 10.11,72.31 -0.05,72.31
N$7  (via drill 0.3)
  Top 0.127: v71.83,6.02 65.99,6.02 65.48,5.51 SJ2.2 | v69.55,64.19 67.27,64.19 R15.2
  Bottom 0.127: v71.83,6.02 71.83,10.37 72.1,10.63 72.1,54.67 71.55,55.22 71.55,62.18 v69.55,64.19
N$8  (via drill 0.3)
  Top 0.127: SJ3.2 69.55,3.99 v69.8,3.73 | v72.61,14.4 65.96,14.4 64.43,15.94 v60.93,15.94 | v50.75,15.93 45.67,15.93 43.89,17.7 41.58,17.7 41.57,17.71 36.26,17.71 v36.02,17.96 | v34.75,28.37 29.64,28.37 29.12,27.85 28.69,27.85 28.39,28.16 28.39,28.88 R16.2
  Route2 0.127: v69.8,3.73 69.8,4.78 69.54,5.04 69.54,5.47 70.08,6.02 70.43,6.02 70.73,6.32 70.73,7.46 72.34,9.07 72.34,14.13 v72.61,14.4 | v60.93,15.94 58.84,15.94 58.58,15.68 57.44,15.68 56.77,16.34 54.18,16.34 53.67,15.83 53.24,15.83 53.14,15.93 v50.75,15.93
  Bottom 0.127: v36.02,17.96 36.02,24.08 36.01,24.09 36.01,27.11 v34.75,28.37
PE0  (via drill 0.3)
  Top 0.127: IC1.2 61.33,38.7 61.67,39.04 v64.47,39.04 | v64.21,56.31 R12.2 | v64.47,65.96 67.53,65.96 R4.2 | v63.96,74.35 65.68,74.35 Q2.D
  Bottom 0.127: v64.47,39.04 64.47,46.69 64.46,46.7 64.46,56.07 v64.21,56.31 64.21,63.07 64.18,63.1 64.18,65.68 v64.47,65.96 64.47,69.55 64.48,69.56 64.48,73.83 v63.96,74.35
PE0_3.3V  (via drill 0.3)
  Top 0.127: R2.2 74.5,65.6 U2.3 74.5,70.15 72.85,71.81 v69.29,71.81 | v69.29,75.11 67.83,75.11 Q2.S
  Bottom 0.127: v69.29,71.81 69.29,72.72 69.26,72.75 69.26,73.4 69.29,73.43 v69.29,75.11
PE1  (via drill 0.3)
  Top 0.127: IC1.3 60.91,37.22 60.91,38.75 61.72,39.56 v63.45,39.56 | v62.94,55.73 58.71,55.73 58.63,55.65 56.22,55.65 R11.2 | R3.2 70.82,65.2 69.55,66.47 64.69,66.47 64.68,66.48 63.46,66.48 v62.94,65.96 | Q1.D v63.96,69.77
  Bottom 0.127: v63.45,39.56 63.71,39.56 64.14,39.98 64.14,46.55 64.12,46.56 64.12,54.55 v62.94,55.73 v62.94,65.96 63.96,66.98 v63.96,69.77
PE1_3.3V
  Top 0.127: R1.2 73.23,65.34 U2.2 73.1,69.52 73.1,71.04 72.85,71.3 70.31,71.3 69.81,70.8 Q1.S
PK3  (via drill 0.3)
  Top 0.127: IC1.86 67.26,28.13 67.3,28.1 67.73,28.1 67.75,28.12 v69.8,28.12 | U4.1 69.67,47.29 v70.05,46.91
  Bottom 0.127: v69.8,28.12 69.8,46.66 v70.05,46.91
PK4  (via drill 0.3)
  Top 0.127: U4.10 73.6,53.76 v73.61,53.77 | IC1.85 69.55,27.63 69.58,27.6 70.01,27.6 70.05,27.63 72.9,27.63 v73.13,27.86
  Bottom 0.127: v73.61,53.77 73.61,52.68 74.13,52.16 74.13,51.73 74.12,51.72 74.12,50.69 74.11,50.68 74.11,49.93 74.13,49.91 74.13,48.93 74.11,48.91 74.11,47.91 74.13,47.89 74.13,47.43 73.1,46.41 73.1,27.89 v73.13,27.86
PK5  (via drill 0.3)
  Top 0.127: U4.11 72.98,54.41 v73.1,54.53 | IC1.84 68.02,27.13 | 68.02,27.13 68.26,27.13 | 69.02,27.13 68.8,27.13 | 69.02,27.13 72.58,27.13 v72.61,27.1 | 68.02,27.13 69.02,27.13
  Bottom 0.127: v73.1,54.53 73.1,54 72.58,53.48 72.58,48.98 72.61,48.95 v72.61,27.1
PK6  (via drill 0.3)
  Top 0.127: IC1.83 67.25,26.63 67.3,26.58 67.73,26.58 67.74,26.59 v69.55,26.59 | U4.14 66.87,54.41 v67.01,54.28 68.78,56.06 v69.55,56.06
  Bottom 0.127: v67.01,54.28 67.01,54.82 67,54.83 67,55.26 67.01,55.27 v67.01,58.09 | v69.55,26.59 69.55,27.64 69.28,27.9 69.28,46.87 69.55,47.14 v69.55,56.06
PK7  (via drill 0.3)
  Top 0.127: IC1.82 65.94,26.13 v65.99,26.09 | v59.64,55.04 62.8,55.04 U4.13
  Bottom 0.127: v65.99,26.09 63.96,26.09 60.4,29.64 60.4,35.7 60.41,35.71 60.41,45.38 59.39,46.41 59.39,53.41 59.36,53.44 59.36,54.76 v59.64,55.04
RESET  (via drill 0.3)
  Top 0.127: IC1.30 44.21,33.13 v44.15,33.2 43.64,33.2 42.37,34.47 42.08,34.47 42.07,34.48 40.58,34.48 v40.34,34.72 | v28.07,41.58 28.58,41.07 v36.27,41.07 | C13.2 11.38,76.63 SJ1.1 SJ1.2 15.19,76.12 v15.44,75.87 | CR3.2 6.47,70.36 v6.81,70.03 | v7.06,64.95 17.48,64.95 J$14.1 | C7.2 7.89,3.29 8.92,4.32 14.11,4.32 R5.2 14.19,3.24 v13.92,2.97
  Route2 0.127: v13.92,2.97 14.43,2.97 15.95,4.5 15.95,8.97 16.34,9.36 16.34,9.79 16.13,10 16.13,19.79 17.07,20.73 18.21,20.73 20.52,23.04 20.52,27.61 v20.02,28.12
  Bottom 0.127: v40.34,34.72 40.34,38.5 38.77,40.07 38.04,40.07 36.78,41.33 36.53,41.33 v36.27,41.07 | 17.98,64.44 25.35,57.07 25.35,49.71 28.07,46.99 v28.07,41.58 20.79,34.3 20.79,32.22 20.02,31.45 v20.02,28.12 | 17.98,64.44 J$14.1 | v15.44,75.87 15.44,66.98 17.98,64.44 | v6.81,70.03 6.81,65.2 v7.06,64.95
RESET2  (via drill 0.3)
  Top 0.127: U3.24 57.33,53.74 v57.35,53.77 56.01,55.11 46.96,55.11 45.94,54.1 36.97,54.1 36.29,54.79 v33.73,54.79 | v36.53,0.94 68.96,0.94 CR4.2 71.5,4.67 72.09,5.26 v85.57,5.26 | v85.57,10.59 87.57,10.59 R10.2
  Bottom 0.127: v33.73,54.79 33.22,54.28 J2.1 33.22,28.88 34.24,27.86 34.24,25.29 35.18,24.35 35.18,2.29 v36.53,0.94 | v85.57,5.26 v85.57,10.59
RESET_TCA  (via drill 0.3)
  Top 0.127: U5.3 28.15,24.8 v28.4,24.56 | v28.91,28.37 29.17,28.37 R14.2
  Bottom 0.127: v28.4,24.56 28.4,27.86 v28.91,28.37
RX1  (via drill 0.3)
  Top 0.127: IC1.45 46.2,25.63 44.36,23.79 43.93,23.79 43.92,23.8 v42.11,23.8 | v20.02,16.93 41.09,16.93 v41.35,17.2
  Bottom 0.127: J$13.1 17.73,4.5 19.76,6.53 19.76,16.68 v20.02,16.93 | v41.35,17.2 41.35,23.04 v42.11,23.8
RX+
  Top 0.127: J$1.4 64.26,77.09 65.23,76.12 70.05,76.12 U2.8
RX-
  Top 0.127: J$1.3 68.22,77.95 69.72,76.45 72.52,76.45 73.1,75.87 73.1,74.35 U2.7
SCK  (via drill 0.3)
  Top 0.127: J$8.7 J$7.7 19.34,40.55 44.87,40.55 | J$8.10 J$7.10 | J$8.4 J$7.4 | J$8.1 J$7.1 | IC1.20 52.25,37.22 52.25,37.99 50.39,39.85 47.45,39.85 v47.26,40.04 46.75,40.55 44.87,40.55 | 44.88,40.56 44.87,40.55
  Bottom 0.127: J$7.1 17.73,16.86 19.33,18.46 19.33,23.75 17.73,25.35 J$7.4 17.73,28.75 19.33,30.35 19.33,35.64 17.73,37.24 J$7.7 17.73,40.64 19.33,42.24 19.33,47.53 17.73,49.13 J$7.10
SCK2  (via drill 0.3)
  Top 0.127: U3.15 54.29,48.97 54.81,48.44 v55.58,48.44 | J2.4 47.2,42.85 47.23,42.82 55.54,42.82 v55.83,43.1
  Bottom 0.127: v55.83,43.1 55.83,48.18 v55.58,48.44
SCL  (via drill 0.3)
  Top 0.127: v42.11,25.32 43.9,25.32 43.93,25.29 44.36,25.29 45.7,26.63 IC1.43 62.14,26.63 v62.18,26.59 | J$6.12 J$5.12 | J$6.10 J$5.10 | J$6.8 J$5.8 | v33.73,17.45 11.79,17.45 J$5.2 | J$5.4 10.11,27.36 11.81,29.06 20.37,29.06 20.9,28.53 23.92,28.53 v24.84,27.61 | v26.87,24.05 28.17,24.05 28.18,24.04 29.2,24.04 29.76,24.6 30.5,24.6 U5.22 34,24.8 v34.24,24.56 34.49,24.31 v36.53,24.31 | v64.47,20 70.29,20 v71.06,19.23 | v69.8,2.72 68.82,2.72 68.74,2.64 68.71,2.64 SJ3.1 | R6.2 8.85,3.24 v8.84,3.23
  Route2 0.127: v7.19,12.37 9.09,12.37 9.6,12.88 9.6,13.41 8.08,14.93 8.08,17.09 J$5.2
  Bottom 0.127: v34.24,24.56 34.24,17.96 v33.73,17.45 | v24.84,27.61 24.84,26.09 v26.87,24.05 | J$5.2 10.11,20.83 8.51,22.43 8.51,23.75 10.11,25.35 J$5.4 10.11,28.75 8.51,30.35 8.51,31.68 10.11,33.28 J$5.6 10.11,36.67 8.51,38.28 8.51,39.6 10.11,41.2 J$5.8 10.11,44.6 8.51,46.2 8.51,47.53 10.11,49.13 J$5.10 10.11,52.52 8.51,54.12 8.51,55.45 10.11,57.05 J$5.12 | v42.11,25.32 37.54,25.32 v36.53,24.31 | v62.18,26.59 62.18,22.29 v64.47,20 | v71.06,19.23 71.06,3.98 v69.8,2.72 | v7.19,12.37 8.32,11.24 8.32,5.93 8.84,5.41 v8.84,3.23
SDA  (via drill 0.3)
  Top 0.127: J$6.11 J$5.11 | J$6.9 J$5.9 | J$6.7 J$5.7 | U5.23 33.35,25.45 v33.48,25.32 | v32.72,17.97 v20.02,17.97 | v20.02,21.26 11.94,21.26 J$5.3 | v33.48,23.8 36.3,23.8 36.31,23.79 36.74,23.79 36.75,23.8 37.29,23.8 37.81,24.32 42.33,24.32 42.34,24.31 v44.15,24.31 45.97,26.13 IC1.44 57.05,26.13 59.39,23.8 60.91,23.8 61.93,22.78 62.9,22.78 62.97,22.72 70.12,22.72 v70.82,22.02 | SJ2.1 v67.01,2.46 | v67.01,5.26 v70.05,5.26 | R7.2 11.65,3.24 v11.38,2.97
  Route2 0.127: v11.38,2.97 11.38,4.5 14.94,8.05 14.94,12.88 14.68,13.13 12.14,13.13 J$5.1
  Bottom 0.127: v33.48,25.32 v33.48,23.8 33.48,18.73 v32.72,17.97 | v20.02,17.97 v20.02,21.26 | J$5.1 10.11,16.86 11.71,18.46 11.71,19.79 10.11,21.39 J$5.3 10.11,24.79 11.71,26.39 11.71,27.71 10.11,29.31 J$5.5 10.11,32.71 11.71,34.31 11.71,35.64 10.11,37.24 J$5.7 10.11,40.64 11.71,42.24 11.71,43.56 10.11,45.16 J$5.9 10.11,48.56 11.71,50.16 11.71,51.49 10.11,53.09 J$5.11 | v70.82,22.02 70.82,19.99 70.05,19.23 70.05,19.2 69.79,18.93 69.79,18.5 69.8,18.49 69.8,15.67 70.73,14.74 70.73,5.93 v70.05,5.26 | v67.01,2.46 v67.01,5.26
TEC1_ENABLE  (via drill 0.3)
  Top 0.127: IC1.40 45.43,28.13 v44.15,26.85 | v42.62,14.91 41.09,14.91 41.06,14.88 20.3,14.88 18.49,16.69 18.47,16.69 18.39,16.76 2.77,16.76 J$15.9
  Bottom 0.127: v42.62,14.91 43.05,15.34 43.05,25.45 44.15,26.54 v44.15,26.85
TEC1_INPUT1  (via drill 0.3)
  Top 0.127: IC1.50 44.97,23.13 44.36,22.52 43.93,22.52 43.92,22.53 v42.11,22.53 | v41.86,16.43 21.04,16.43 v20.28,15.67 | v20.28,9.83 16.08,9.83 v15.82,9.58 | v15.19,4.65 2.54,4.65 J$15.12
  Bottom 0.127: v42.11,22.53 42.11,16.69 v41.86,16.43 | v20.28,15.67 v20.28,9.83 | v15.82,9.58 15.82,5.28 v15.19,4.65
TEC1_INPUT2  (via drill 0.3)
  Top 0.127: IC1.42 45.63,27.13 44.5,26 44.33,26 v44.15,25.81 | v42.62,1.46 17.3,1.46 16.42,2.34 9.59,2.34 8.45,1.19 8.45,0.99 8.29,0.84 3.35,0.84 v0.71,3.48
  Bottom 0.127: v44.15,25.81 44.12,25.81 43.38,25.07 43.38,2.22 v42.62,1.46 | J$15.11 0.97,8.56 0.71,8.31 v0.71,3.48
TEC2_ENABLE  (via drill 0.3)
  Top 0.127: IC1.39 45.39,28.63 44.36,27.6 v43.17,27.6 | J$15.8 4.98,20.45 5.54,21.01 11.73,21.01 11.99,20.74 21.32,20.74 v23.57,18.49 | v26.37,14.36 v40.34,14.36 | v40.31,21.77 44.91,21.77 v45.42,22.28
  Bottom 0.127: v23.57,18.49 23.57,17.15 v26.37,14.36 | v40.34,14.36 40.34,15.17 40.33,15.18 v40.33,21.76 v40.31,21.77 | v43.17,27.6 43.41,27.37 44.36,27.37 45.42,26.31 v45.42,22.28
TEC2_INPUT1  (via drill 0.3)
  Top 0.127: IC1.41 45.66,27.63 44.36,26.33 43.93,26.33 43.92,26.34 v42.11,26.34 | J$15.10 2.49,10.82 3.15,10.16 4.09,9.22 4.09,6.2 5.31,4.98 14.79,4.98 15.14,5.33 23.65,5.33 v23.83,5.51 | v24.59,15.4 v40.84,15.4
  Bottom 0.127: v23.83,5.51 23.83,6.31 23.9,6.39 23.9,14.71 v24.59,15.4 | v40.84,15.4 40.84,16.97 40.83,16.98 40.83,23.31 42.63,25.11 42.63,25.54 42.11,26.06 v42.11,26.34
TEC2_INPUT2  (via drill 0.3)
  Top 0.127: IC1.37 45.12,29.63 44.36,28.87 42.36,28.87 v42.11,28.63 | J$15.6 5.36,28.37 5.64,28.65 6.96,28.65 6.99,28.63 v8.84,28.63
  Route2 0.127: v8.84,28.63 9.42,28.63 9.45,28.65 21.68,28.65 21.8,28.53 28.33,28.53 28.69,28.89 39.59,28.89 39.87,28.62 40.3,28.62 40.31,28.63 v42.11,28.63
TEC3_ENABLE  (via drill 0.3)
  Top 0.127: IC1.38 45.16,29.13 v44.15,28.12 42.34,28.12 42.33,28.11 41.9,28.11 41.89,28.12 v38.3,28.12 | J$15.7 5.13,24.41 5.54,24.82 5.79,25.07 7.81,25.07 8.08,24.81 22.75,24.81 v23.78,25.83 | v36.27,33.71 27.06,33.71 26.83,33.48 25.39,33.48 25.16,33.71 v23.32,33.71
  Bottom 0.127: v38.3,28.12 38.3,31.67 v36.27,33.71 | v23.32,33.71 23.32,33.04 23.22,32.94 23.22,26.39 v23.78,25.83
TEC3_INPUT1  (via drill 0.3)
  Top 0.127: IC1.36 44.89,30.13 v44.15,29.39 42.34,29.39 42.33,29.38 40.33,29.38 v40.08,29.13 | v39.28,33.66 36.96,33.66 36.49,33.19 27.88,33.19 v27.64,32.94 | v25.1,36.74 21.02,36.74 v20.02,35.74 | v20.27,32.44 19.51,32.44 19.08,32.87 3.02,32.87 J$15.5
  Bottom 0.127: v40.08,29.13 40.08,32.94 39.32,33.71 39.32,33.7 v39.28,33.66 | v27.64,32.94 27.64,34.2 v25.1,36.74 | v20.02,35.74 20.02,32.69 v20.27,32.44
TEC3_INPUT2  (via drill 0.3)
  Top 0.127: IC1.35 44.63,30.63 44.15,30.15 42.37,30.15 42.29,30.07 | 42.29,30.07 v42.11,29.9 | J$15.4 4.06,36.3 5.03,37.26 19.55,37.26 19.88,37.59 32.27,37.59 v32.46,37.78 | v32.71,31.19 39.3,31.19 v39.32,31.17 | v39.41,29.8 42.02,29.8 42.29,30.07
  Bottom 0.127: v32.46,37.78 32.46,31.43 v32.71,31.19 | v39.32,31.17 39.32,29.9 v39.41,29.8
TEMP  (via drill 0.3)
  Top 0.127: IC1.18 53.25,37.22 53.25,37.99 51.06,40.18 48.14,40.18 v47.96,40.37 | v47.45,43.34 43.15,43.34 41.68,44.81 20.07,44.81 | 20.07,44.81 4.92,44.81 v4.28,44.16 | U8.1 21.3,43.57 20.07,44.81 | U7.1 17.94,80.91 v17.48,80.44 18.75,81.71 50.6,81.71 J$1.7 J$1.6 J$1.5 62.08,81.71 77.42,81.71 78.68,80.45 R17.1 | v14.94,41.33 14.61,41.33 14.58,41.3 3.53,41.3 J$15.3 | U6.1 71.36,11.06 v71.58,10.85 | v70.82,35.48 64.76,35.48 64.33,35.91 59.92,35.91 v59.89,35.93 | v59.64,33.97 58.89,33.97 58.7,33.78 53.93,33.78 53.33,34.39 IC1.18 | 53.25,37.05 IC1.18
  Bottom 0.127: v47.96,40.37 47.96,42.83 v47.45,43.34 | v4.28,44.16 4.28,42.05 J$15.3 | v17.48,80.44 17.48,77.65 16.71,76.89 15.44,76.89 14.68,76.12 14.68,72.46 14.72,72.42 14.72,60.59 15.7,59.61 15.7,51.78 15.85,51.62 15.85,46.06 15.7,45.91 15.7,42.09 v14.94,41.33 | v71.58,10.85 71.58,34.72 v70.82,35.48 | v59.89,35.93 59.89,34.22 v59.64,33.97
THERMISTOR1  (via drill 0.3)
  Top 0.127: J$9.12 87.02,68.91 84.29,66.18 77.13,66.18 v76.91,65.96 | v74.88,32.94 74.88,32.69 74.53,32.34 71.47,32.34 70.43,33.38 70.27,33.54 70.17,33.63 IC1.97
  Bottom 0.127: v76.91,65.96 76.91,39.04 75.39,37.52 75.39,33.45 v74.88,32.94
THERMISTOR2  (via drill 0.3)
  Top 0.127: J$9.11 88.85,64.68 v87.34,63.17 | v87.92,58.68 86.9,58.68 v86.56,58.34 | v86.82,38.03 84.07,38.03 83.38,37.34 82.93,37.34 | 82.93,37.34 | 82.93,37.34 82.04,37.34 81.89,37.19 80.57,37.19 80.23,37.53 77.43,37.53 v76.66,36.75 | v76.66,34.21 76.66,33.92 74.75,32.01 71.33,32.01 70.2,33.14 70.19,33.13 IC1.96
  Bottom 0.127: v87.34,63.17 87.34,61.73 87.25,61.65 87.25,59.36 v87.92,58.68 | v86.56,58.34 86.56,56.24 86.64,56.16 86.64,38.21 v86.82,38.03 | v76.66,36.75 v76.66,34.21
THERMISTOR3  (via drill 0.3)
  Top 0.127: J$9.10 85.78,60.99 85.7,61.06 83.09,61.06 v83.01,61.15 | v83.01,36.49 80.37,36.49 v79.91,36.04 | v79.96,33.46 77.89,33.46 77.52,33.83 77.03,33.83 74.88,31.68 71.2,31.68 70.24,32.63 IC1.95
  Bottom 0.127: v83.01,61.15 v83.01,36.49 | v79.91,36.04 79.91,35.77 79.63,35.49 79.63,33.79 v79.96,33.46
THERMISTOR4  (via drill 0.3)
  Top 0.127: v77.31,33.31 75.35,31.35 71.06,31.35 70.39,32.01 70.33,32.08 70.27,32.13 IC1.94 | v78.18,65.05 79.35,65.05 79.88,64.52 83.87,64.52 84.38,65.02 85.7,65.02 85.78,64.95 v86.31,64.95
  Bottom 0.127: v77.31,33.31 77.31,36.48 77.26,36.53 77.26,64.13 v78.18,65.05 | v86.31,64.95 86.31,64.69 86.82,64.19 86.82,59.05 J$9.9
THERMISTOR5  (via drill 0.3)
  Top 0.127: v90.63,34.98 87.33,34.98 86.06,33.71 84.02,33.71 83.26,32.94 77.67,32.94 75.75,31.02 70.92,31.02 70.31,31.63 IC1.93
  Bottom 0.127: v90.63,34.98 90.63,51.28 J$9.8
THERMISTOR6  (via drill 0.3)
  Top 0.127: v77.94,32.17 76.41,30.63 70.84,30.63 70.34,31.13 IC1.92 | v77.92,49.71 79.93,49.71 80.57,49.07 82.02,49.07 82.12,49.17 85.7,49.17 85.78,49.1 J$9.7
  Bottom 0.127: v77.94,32.17 77.94,36.31 77.59,36.67 77.59,43.23 77.92,43.56 v77.92,49.71
THERMISTOR7  (via drill 0.3)
  Top 0.127: 70.48,30.49 70.39,30.58 | 70.48,30.49 70.66,30.3 77.36,30.3 v77.97,30.91 | v82.19,45.15 84.03,45.15 84.53,45.64 88.34,45.64 J$9.6 | IC1.91 70.33,30.63 70.48,30.49
  Bottom 0.127: v77.97,30.91 77.97,31.46 78.54,32.03 78.54,36.18 77.92,36.8 77.92,43.09 78.94,44.12 80.21,44.12 80.98,44.88 81.93,44.88 v82.19,45.15
THERMISTOR8  (via drill 0.3)
  Top 0.127: v78.49,30.16 78.3,29.97 70.49,29.97 70.32,30.13 IC1.90 | v78.44,41.07 83.77,41.07 84.28,41.58 88.44,41.58 J$9.5
  Bottom 0.127: v78.49,30.16 78.49,30.97 78.87,31.34 78.87,36.32 78.44,36.75 v78.44,41.07
THERMISTOR9  (via drill 0.3)
  Top 0.127: 69.55,29.64 70.05,29.64 | 70.05,29.64 78.94,29.64 v79.2,29.9 | J$9.4 88.54,37.52 84.02,37.52 83.52,37.01 82.79,37.01 82.6,36.82 80.4,36.82 80.21,37.01 v79.2,37.01 | 70.05,29.64 IC1.89
  Bottom 0.127: v79.2,29.9 v79.2,37.01
THERMISTOR10  (via drill 0.3)
  Top 0.127: v86.82,29.9 86.74,29.97 82.62,29.97 81.78,29.13 IC1.88 | v87.07,33.2 88.8,33.2 J$9.3
  Bottom 0.127: v86.82,29.9 86.82,32.94 v87.07,33.2
THERMISTOR11  (via drill 0.3)
  Top 0.127: IC1.87 67.5,28.63 v67.51,28.62 68.26,28.62 68.31,28.56 69.26,28.56 69.33,28.64 81.75,28.64 82.75,29.64 85.29,29.64 85.57,29.36 85.7,29.36 85.78,29.29 J$9.2
THERMISTOR12  (via drill 0.3)
  Top 0.127: J$10.7 84.94,39.65 83.85,40.74 79.88,40.74 v79.45,40.31 | v77.78,52.5 69.71,52.5 U4.8
  Route2 0.127: v79.45,40.31 79.45,48.47 79.46,48.48 79.46,50.81 v77.78,52.5
THERMISTOR13  (via drill 0.3)
  Top 0.127: U4.7 73.48,51.81 v73.61,51.94 77.6,51.94 v77.87,51.68
  Route2 0.127: v77.87,51.68 77.87,50.39 77.4,49.92 77.4,40.35 80.57,37.19 80.8,37.19 81.23,36.75 82.54,36.75 82.79,37.01 83.72,37.01 J$10.8
THERMISTOR14  (via drill 0.3)
  Top 0.127: U4.6 72.92,51.16 v73.1,50.98 | v74.63,28.12 79.2,28.12 v79.45,27.86
  Route2 0.127: v73.1,50.98 73.1,49.93 72.58,49.41 72.58,30.16 v74.63,28.12
  Bottom 0.127: v79.45,27.86 79.93,27.86 80.57,28.5 82.88,28.5 83.52,29.13 83.52,31.17 84.02,31.67 84.99,31.67 J$10.9
THERMISTOR15  (via drill 0.3)
  Top 0.127: U4.5 72.55,50.51 72.85,50.22 74.37,50.22 v74.63,50.47 75.16,50.47 75.43,50.21 75.9,50.21 v76.39,49.71 | v76.16,39.55 78.94,39.55 v79.44,39.04
  Route2 0.127: v83.55,38.24 82.83,38.96 82.83,39.45 81.89,40.39 80.57,40.39 79.63,39.45 79.63,39.23 v79.44,39.04 | v86.2,33.09 86.2,32.82 86.64,32.39 86.64,31.06 86.2,30.62 86.2,28.92 J$10.10
  Bottom 0.127: v76.39,49.71 76.39,39.78 v76.16,39.55 | v83.55,38.24 84.51,37.29 85.7,37.29 86.64,36.35 86.64,35.02 86.2,34.59 v86.2,33.09
THERMISTOR16  (via drill 0.3)
  Top 0.127: U4.4 73.45,49.86 v73.61,49.7 | J$10.11 83.77,23.8 83.01,24.56 74.13,24.56 v73.87,24.31
  Route2 0.127: v74.37,44.37 74.37,45.93 74.64,46.19 74.64,47.18 75.13,47.68 75.13,48.47 75.14,48.48 75.14,48.91 75.13,48.92 75.13,49.45 73.85,49.45 v73.61,49.7
  Bottom 0.127: v73.87,24.31 73.87,27.4 73.98,27.51 73.98,43.98 v74.37,44.37
THERMISTOR17  (via drill 0.3)
  Top 0.127: U4.3 v73.09,49.21 v73.1,49.2 | J$10.12 83.92,19.84 83.01,20.75 74.88,20.75 v73.36,22.28
  Route2 0.127: v74.12,46.41 74.12,48.18 v73.1,49.2
  Bottom 0.127: v73.36,22.28 73.36,27.35 73.65,27.65 73.65,45.94 v74.12,46.41
THERMISTOR18  (via drill 0.3)
  Top 0.127: U4.2 74.49,48.56 v74.63,48.69 | v75.9,25.08 83.27,25.08 84.02,25.83 88.34,25.83 J$9.1
  Route2 0.127: v74.63,38.53 74.63,35.74 75.64,34.72 75.64,25.33 v75.9,25.08
  Bottom 0.127: v74.63,48.69 74.63,46.63 74.89,46.37 74.89,44.16 74.63,43.89 v74.63,38.53
THERMISTOR19  (via drill 0.3)
  Top 0.127: U4.23 66.15,48.56 66.28,48.43 66.71,48.43 66.72,48.44 v67.77,48.44 | v67.77,45.39 79.96,45.39 80.72,44.63 84.02,44.63 J$10.6
  Bottom 0.127: v67.77,48.44 v67.77,45.39
THERMISTOR20  (via drill 0.3)
  Top 0.127: U4.22 66.23,49.21 v66.5,48.95 | v64.89,57.33 69.04,57.33 69.55,56.82 77.93,56.82 v78.44,56.31 | v78.94,48.69 83.92,48.69 J$10.5
  Bottom 0.127: v66.5,48.95 66.5,49.23 65.08,50.65 65.08,57.14 v64.89,57.33 | v78.44,56.31 78.44,49.2 v78.94,48.69
THERMISTOR21  (via drill 0.3)
  Top 0.127: U4.21 66.6,49.86 v67.01,49.45 | v69.8,57.56 78.2,57.56 v79.45,56.31 | v79.71,52.5 84.07,52.5 J$10.4
  Bottom 0.127: v69.8,57.56 68.69,56.45 68.69,50.66 67.73,49.7 67.25,49.7 v67.01,49.45 | v79.45,56.31 79.45,52.76 v79.71,52.5
THERMISTOR22  (via drill 0.3)
  Top 0.127: U4.20 65.95,50.51 66.24,50.22 v67.51,50.22 | v68.78,58.08 70.04,58.08 70.23,58.27 78.51,58.27 80.21,56.57 83.97,56.57 J$10.3
  Bottom 0.127: v67.51,50.22 67.51,51.72 67.52,51.73 67.52,51.75 68.28,52.5 68.28,54.07 68.36,54.15 68.36,57.66 v68.78,58.08
THERMISTOR23  (via drill 0.3)
  Top 0.127: U4.19 66.31,51.16 v66.5,50.98 | v65.22,59.11 67.26,59.11 67.77,58.6 78.96,58.6 v79.2,58.83 | v80.47,60.63 83.87,60.63 J$10.2
  Bottom 0.127: v66.5,50.98 66.5,51.72 65.41,52.81 65.41,58.92 v65.22,59.11 | v79.2,58.83 79.2,59.36 v80.47,60.63
THERMISTOR24  (via drill 0.3)
  Top 0.127: U4.18 66.87,51.81 v67.01,51.94 | v65.99,60.88 66.75,60.88 67.44,60.2 78.13,60.2 v78.5,60.56 | v78.69,64.19 84.28,64.19 J$10.1
  Bottom 0.127: v67.01,51.94 66.8,51.94 65.74,53.01 65.74,59.64 65.73,59.65 65.73,60.62 v65.99,60.88 | v78.5,60.56 78.5,64 v78.69,64.19
THERMISTOR25  (via drill 0.3)
  Top 0.127: U4.17 67.47,52.46 v67.51,52.5 | v68.02,59.35 80.48,59.35 J$11.11
  Bottom 0.127: v67.51,52.5 67.51,53.77 68.02,54.28 68.02,54.82 68.03,54.83 68.03,55.26 68.02,55.27 v68.02,59.35
THERMISTOR26  (via drill 0.3)
  Top 0.127: U4.16 66.34,53.11 v66.5,53.26 | v66.24,59.87 78.54,59.87 J$11.12
  Bottom 0.127: v66.5,53.26 66.5,54.05 66.49,54.06 66.49,59.62 v66.24,59.87
THERMISTOR27
  Top 0.127: U4.9 79.7,53.11 J$11.10
TX1  (via drill 0.3)
  Top 0.127: IC1.46 46.24,25.13 v44.15,23.04 | v23.57,15.92 44.14,15.92 v44.15,15.93
  Bottom 0.127: J$13.2 21.69,4.65 23.57,6.53 v23.57,15.92 | v44.15,15.93 v44.15,23.04
TX+
  Top 0.127: J$1.2 72.85,79.93 74.37,78.41 74.37,74.35 U2.6
TX-
  Top 0.127: J$1.1 76.15,74.6 U2.5
VIN  (via drill 0.7)
  Top 0.508: C1.2 v29.41,50.72 | v29.16,59.36 29.15,59.37 CR2.3 24.25,62.15 CR1.1
  Route2 0.406: v29.41,50.72 29.41,53.72 30.09,54.4 30.09,58.43 v29.16,59.36
  Route2 0.61: J$2.12 18.59,76.02 20.52,74.09 21.73,74.09 21.79,74.15 24.55,74.15 J$2.10 26.52,75.97 | 26.52,75.97 28.65,73.84 29.4,73.84 29.72,74.15 32.47,74.15 J$2.8 34.44,75.92 | 34.44,75.92 36.53,73.84 37.32,73.84 37.64,74.15 40.4,74.15 J$2.6 | v29.16,59.36 29.16,62.55 27.78,63.93 27.78,65.46 28.64,66.32 28.64,73.85 26.52,75.97 | J$1.12 32.56,77.8 34.44,75.92
XT1  (via drill 0.3)
  Top 0.127: U3.1 48.75,53.74 v48.72,53.77 | R9.2 51.56,57.85 C11.2 51.32,58.79 51,59.11 46.72,59.11 45.07,57.45 | v48.21,58.09 45.71,58.09 45.07,57.45 | 45.07,57.45 Q4.1
  Bottom 0.127: v48.72,53.77 48.72,57.58 v48.21,58.09
XT2  (via drill 0.3)
  Top 0.127: U3.2 48.23,53.24 v48.21,53.26 | C10.2 51.33,56.3 R9.1 54.22,56.3 v54.71,55.8 | 45.01,47.76 Q4.2 | 45.01,47.76 47.79,47.76 v47.96,47.93 | v54.05,44.87 46.44,44.87 44.91,46.41 44.91,47.66 45.01,47.76
  Bottom 0.127: v47.96,47.93 47.96,53.01 v48.21,53.26 | v54.71,55.8 54.71,45.53 v54.05,44.87
XTAL1  (via drill 0.3)
  Top 0.127: IC1.34 44.16,31.13 v44.15,31.12 39.99,31.12 36.53,27.65 | 36.53,27.65 Q3.1 35.98,27.1 26.62,27.1 26.11,27.61 C9.1 | R8.2 35.06,29.12 36.53,27.65
XTAL2  (via drill 0.3)
  Top 0.127: IC1.33 42.41,31.63 v42.11,31.93 | v41.86,33.96 39.72,33.96 36.59,37.09 | 36.55,37.13 36.59,37.09 | 36.55,37.13 Q3.2 | C8.1 33.78,34.28 36.59,37.09 | R8.1 33.97,30.67 v33.99,30.66 | v33.99,36.5 36.27,36.5 36.53,36.25 36.53,37.11 36.55,37.13
  Bottom 0.127: v42.11,31.93 42.11,33.71 v41.86,33.96 | v33.99,30.66 v33.99,36.5